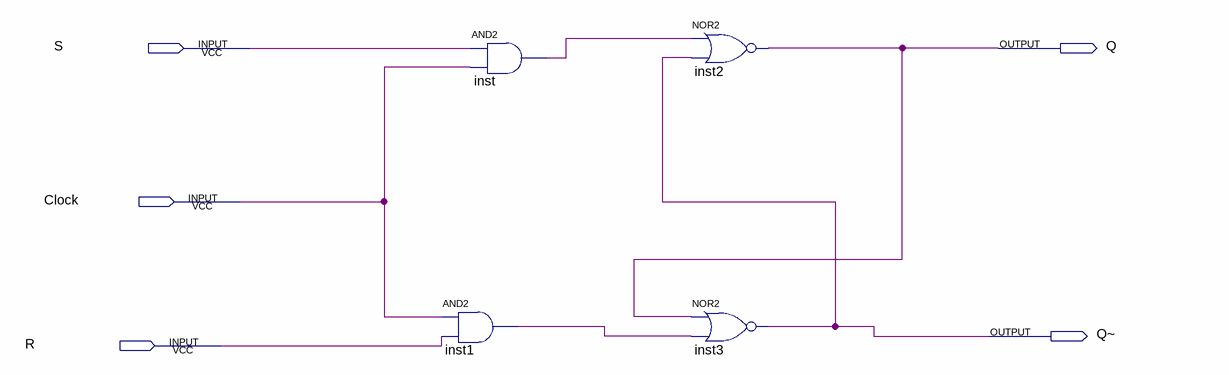
[diagram p0: schematic sheet]
// Quartus schematic SRLatch.bdf as structural Verilog: 4 symbols, 5 pins
module SRLatch (
  input  S,
  input  Clock,
  input  R,
  output Q,
  output \Q~ 
);

  wire inst1_out, inst_out;

  and inst (inst_out, S, Clock);
  and inst1 (inst1_out, Clock, R);
  nor inst2 (Q, inst_out, \Q~ );
  nor inst3 (\Q~ , Q, inst1_out);
endmodule
